# EAGLE schematic 3ch mix (EAGLE 6.4)
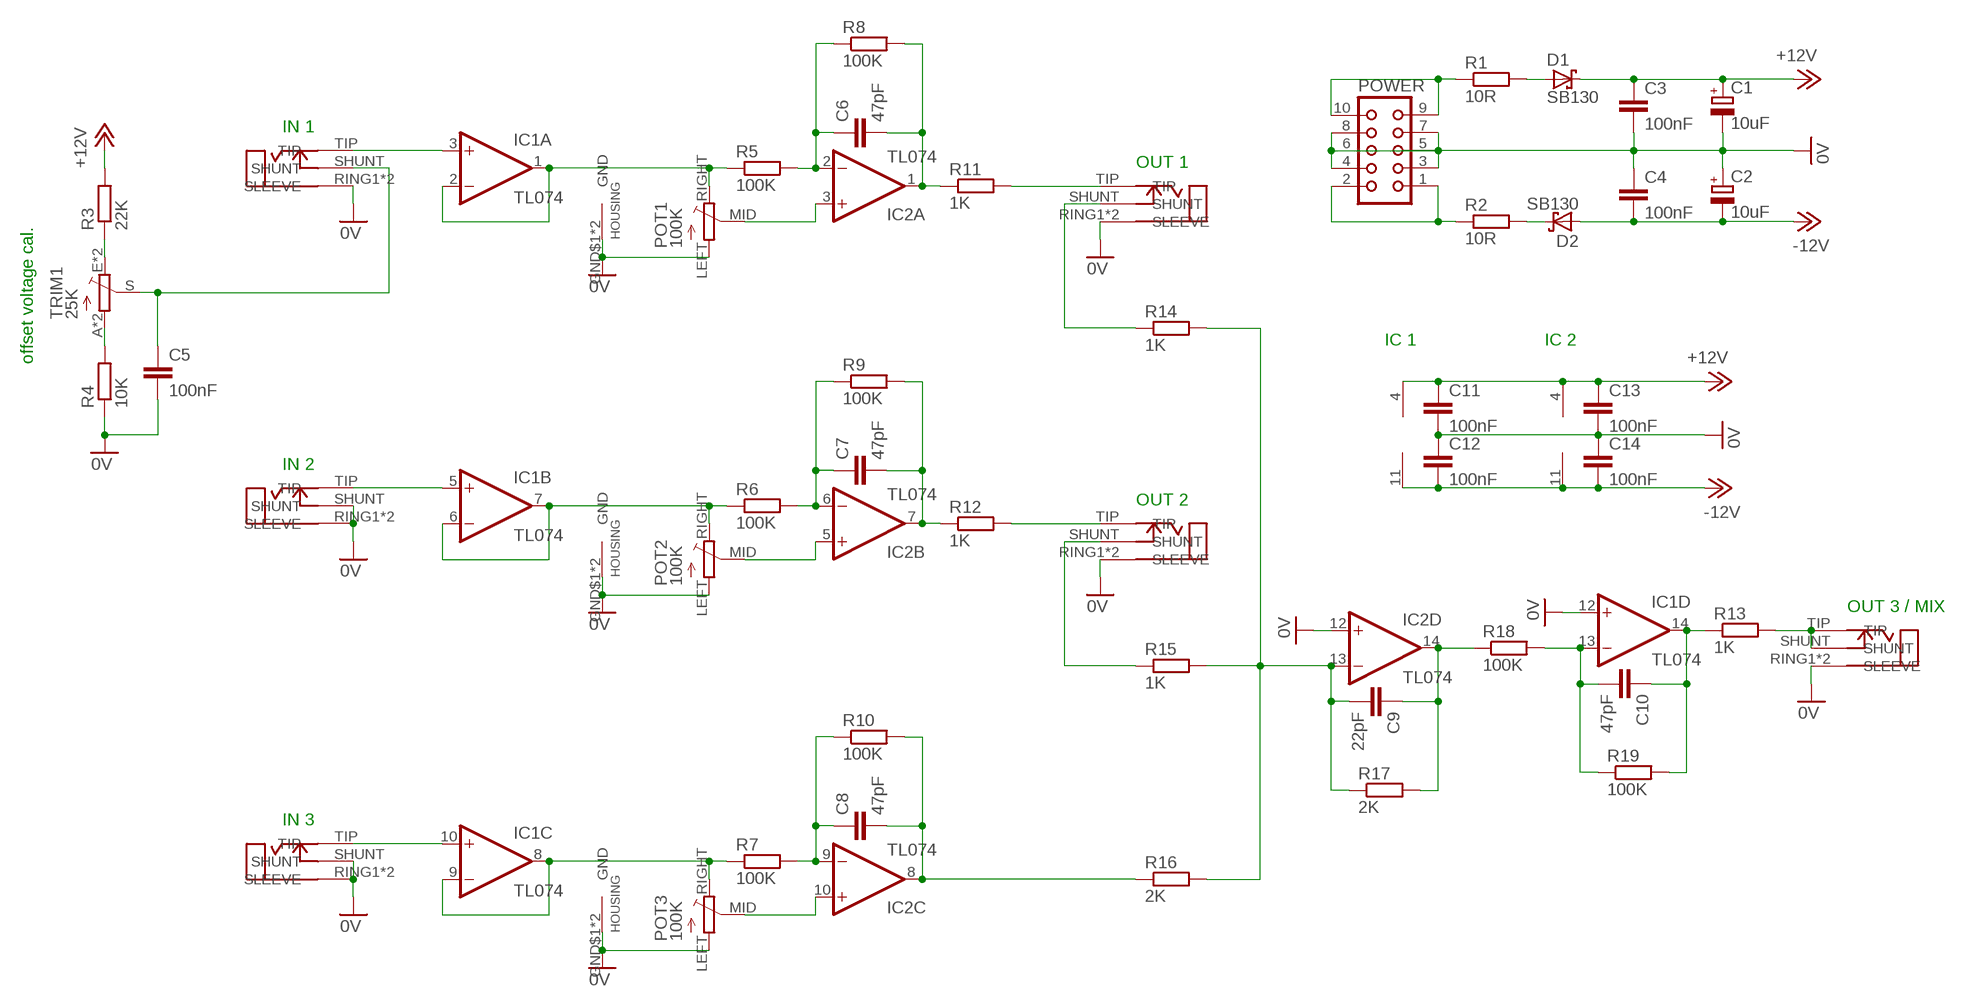
[diagram p0: schematic, sheet 1]

## Parts
C1  10uF  CPOL-EUE2-5  [E2-5]
C2  10uF  CPOL-EUE2-5  [E2-5]
C3  100nF  C-EU025-024X044  [C025-024X044]
C4  100nF  C-EU025-024X044  [C025-024X044]
C5  100nF  C-EU025-024X044  [C025-024X044]
C6  47pF  C-EU025-024X044  [C025-024X044]
C7  47pF  C-EU025-024X044  [C025-024X044]
C8  47pF  C-EU025-024X044  [C025-024X044]
C9  22pF  C-EU025-024X044  [C025-024X044]
C10  47pF  C-EU025-024X044  [C025-024X044]
C11  100nF  C-EU025-024X044  [C025-024X044]
C12  100nF  C-EU025-024X044  [C025-024X044]
C13  100nF  C-EU025-024X044  [C025-024X044]
C14  100nF  C-EU025-024X044  [C025-024X044]
D1  SB130  SB130DO-204AL  [DO41-7]
D2  SB130  SB130DO-204AL  [DO41-7]
IC1  TL074  TL074P  [DIL14]
IC2  TL074  TL074P  [DIL14]
IN1  ERTHENVAR_3.5MM_JACK  [ERTHENVAR]
IN2  ERTHENVAR_3.5MM_JACK  [ERTHENVAR]
IN3  ERTHENVAR_3.5MM_JACK  [ERTHENVAR]
OUT1  ERTHENVAR_3.5MM_JACK  [ERTHENVAR]
OUT2  ERTHENVAR_3.5MM_JACK  [ERTHENVAR]
OUT3  ERTHENVAR_3.5MM_JACK  [ERTHENVAR]
POT1  100K  POT-ALPHA9  [POT-ALPHA9]
POT2  100K  POT-ALPHA9  [POT-ALPHA9]
POT3  100K  POT-ALPHA9  [POT-ALPHA9]
POWER  CON10L  [CON10L]
R1  10R  R-EU_0207/10  [0207/9]
R2  10R  R-EU_0207/10  [0207/9]
R3  22K  R-EU_0207/10  [0207/9]
R4  10K  R-EU_0207/10  [0207/9]
R5  100K  R-EU_0207/10  [0207/9]
R6  100K  R-EU_0207/10  [0207/9]
R7  100K  R-EU_0207/10  [0207/9]
R8  100K  R-EU_0207/10  [0207/9]
R9  100K  R-EU_0207/10  [0207/9]
R10  100K  R-EU_0207/10  [0207/9]
R11  1K  R-EU_0207/10  [0207/9]
R12  1K  R-EU_0207/10  [0207/9]
R13  1K  R-EU_0207/10  [0207/9]
R14  1K  R-EU_0207/10  [0207/9]
R15  1K  R-EU_0207/10  [0207/9]
R16  2K  R-EU_0207/10  [0207/9]
R17  2K  R-EU_0207/10  [0207/9]
R18  100K  R-EU_0207/10  [0207/9]
R19  100K  R-EU_0207/10  [0207/9]
TRIM1  25K  TRIM_EU-B25P  [B25P]

## Nets
0V: C1.- C2.+ C3.2 C4.1 C5.2 C11.2 C12.1 C13.2 C14.1 IC1.12(D:+IN) IC2.12(D:+IN) IN1.RING1(SLEEVE) IN1.RING2(SLEEVE) IN2.RING1(SLEEVE) IN2.RING2(SLEEVE) IN2.SHUNT IN3.RING1(SLEEVE) IN3.RING2(SLEEVE) IN3.SHUNT OUT1.RING1(SLEEVE) OUT1.RING2(SLEEVE) OUT2.RING1(SLEEVE) OUT2.RING2(SLEEVE) OUT3.RING1(SLEEVE) OUT3.RING2(SLEEVE) POT1.GND$1(GND) POT1.GND$2(GND) POT1.LEFT POT2.GND$1(GND) POT2.GND$2(GND) POT2.LEFT POT3.GND$1(GND) POT3.GND$2(GND) POT3.LEFT POWER.3 POWER.4 POWER.5 POWER.6 POWER.7 POWER.8 R4.1
+12V: C1.+ C3.1 C11.1 C13.1 D1.C IC1.4(P:V+) IC2.4(P:V+) R3.2
-12V: C2.- C4.2 C12.2 C14.2 D2.A IC1.11(P:V-) IC2.11(P:V-)
N$1: POWER.9 POWER.10 R1.1
N$2: POWER.1 POWER.2 R2.1
N$4: R4.2 TRIM1.A TRIM1.AA(A)
N$5: D1.A R1.2
N$6: D2.C R2.2
N$7: R3.1 TRIM1.E TRIM1.EE(E)
N$8: C5.1 IN1.SHUNT TRIM1.S
N$9: IC1.3(A:+IN) IN1.TIP
N$10: IC1.5(B:+IN) IN2.TIP
N$11: IC1.10(C:+IN) IN3.TIP
N$12: IC1.1(A:OUT) IC1.2(A:-IN) POT1.RIGHT R5.1
N$13: IC1.6(B:-IN) IC1.7(B:OUT) POT2.RIGHT R6.1
N$14: IC1.8(C:OUT) IC1.9(C:-IN) POT3.RIGHT R7.1
N$15: C6.1 IC2.2(A:-IN) R5.2 R8.1
N$16: IC2.3(A:+IN) POT1.MID
N$17: IC2.5(B:+IN) POT2.MID
N$18: IC2.10(C:+IN) POT3.MID
N$19: OUT1.TIP R11.2
N$20: OUT2.TIP R12.2
N$21: C7.1 IC2.6(B:-IN) R6.2 R9.1
N$22: C8.1 IC2.9(C:-IN) R7.2 R10.1
N$23: C6.2 IC2.1(A:OUT) R8.2 R11.1
N$24: C7.2 IC2.7(B:OUT) R9.2 R12.1
N$25: C8.2 IC2.8(C:OUT) R10.2 R16.1
N$26: OUT1.SHUNT R14.1
N$27: OUT2.SHUNT R15.1
N$28: C9.2 IC2.13(D:-IN) R14.2 R15.2 R16.2 R17.1
N$29: C9.1 IC2.14(D:OUT) R17.2 R18.1
N$30: C10.2 IC1.13(D:-IN) R18.2 R19.1
N$31: C10.1 IC1.14(D:OUT) R13.1 R19.2
N$32: OUT3.SHUNT OUT3.TIP R13.2

## Notes on the sheet
- IN 1
- OUT 1
- HOUSING
- IC 1 | IC 2
- offset voltage cal.
- IN 2
- OUT 2
- HOUSING
- OUT 3 / MIX
- IN 3
- HOUSING

## Library data of the parts
C1 C2 = Roll Your Own:CPOL-EU: POLARIZED CAPACITOR, European symbol
C3-C14 = Roll Your Own:C-EU: CAPACITOR, European symbol
D1 D2 = Roll Your Own:SB130
IC1 IC2 = Roll Your Own:TL074: OP AMP
IN1-IN3 OUT1-OUT3 = Roll Your Own:ERTHENVAR_3.5MM_JACK
POT1-POT3 = Roll Your Own:POT-ALPHA9
POWER = Roll Your Own:CON10L: CONNECTOR; OC_FARNELL: unknown; OC_NEWARK: unknown
R1-R19 = Roll Your Own:R-EU_: RESISTOR, European symbol
TRIM1 = Roll Your Own:TRIM_EU-: POTENTIOMETER